# Altium project XC Tail Lights.PrjPcb
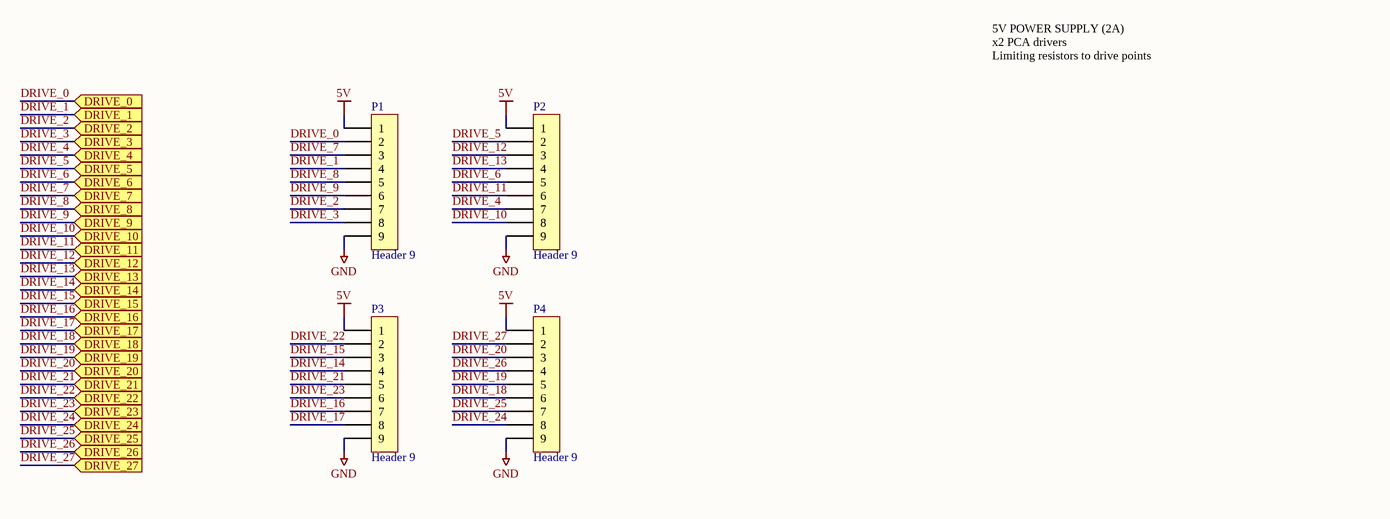
[diagram p0: XC Tail Lights.SchDoc]
3 sheets, 116 parts. Net scope: flat (ports and power ports of the same name join across sheets).
Board files: XC Tail Lights.PcbDoc, LED Module.PcbDoc
Sheets:
  XC Tail Lights.SchDoc
  LED Module.SchDoc
  Current Sinks.SchDoc

## Sheet XC Tail Lights.SchDoc
size A4

### Parts
P1  Header 9  [HEADER 1x9]
P2  Header 9  [HEADER 1x9]
P3  Header 9  [HEADER 1x9]
P4  Header 9  [HEADER 1x9]

### Ports
DRIVE_0 (in), DRIVE_1 (in), DRIVE_2 (in), DRIVE_3 (in), DRIVE_4 (in), DRIVE_5 (in), DRIVE_6 (in), DRIVE_7 (in), DRIVE_8 (in), DRIVE_9 (in), DRIVE_10 (in), DRIVE_11 (in), DRIVE_12 (in), DRIVE_13 (in), DRIVE_14 (in), DRIVE_15 (in), DRIVE_16 (in), DRIVE_17 (in), DRIVE_18 (in), DRIVE_19 (in), DRIVE_20 (in), DRIVE_21 (in), DRIVE_22 (in), DRIVE_23 (in), DRIVE_24 (in), DRIVE_25 (in), DRIVE_26 (in), DRIVE_27 (in)

### Nets
5V: P1.1 P2.1 P3.1 P4.1
GND: P1.9 P2.9 P3.9 P4.9
DRIVE_0: P1.2 ; port DRIVE_0
DRIVE_1: P1.4 ; port DRIVE_1
DRIVE_2: P1.7 ; port DRIVE_2
DRIVE_3: P1.8 ; port DRIVE_3
DRIVE_4: P2.7 ; port DRIVE_4
DRIVE_5: P2.2 ; port DRIVE_5
DRIVE_6: P2.5 ; port DRIVE_6
DRIVE_7: P1.3 ; port DRIVE_7
DRIVE_8: P1.5 ; port DRIVE_8
DRIVE_9: P1.6 ; port DRIVE_9
DRIVE_10: P2.8 ; port DRIVE_10
DRIVE_11: P2.6 ; port DRIVE_11
DRIVE_12: P2.3 ; port DRIVE_12
DRIVE_13: P2.4 ; port DRIVE_13
DRIVE_14: P3.4 ; port DRIVE_14
DRIVE_15: P3.3 ; port DRIVE_15
DRIVE_16: P3.7 ; port DRIVE_16
DRIVE_17: P3.8 ; port DRIVE_17
DRIVE_18: P4.6 ; port DRIVE_18
DRIVE_19: P4.5 ; port DRIVE_19
DRIVE_20: P4.3 ; port DRIVE_20
DRIVE_21: P3.5 ; port DRIVE_21
DRIVE_22: P3.2 ; port DRIVE_22
DRIVE_23: P3.6 ; port DRIVE_23
DRIVE_24: P4.8 ; port DRIVE_24
DRIVE_25: P4.7 ; port DRIVE_25
DRIVE_26: P4.4 ; port DRIVE_26
DRIVE_27: P4.2 ; port DRIVE_27

### Notes on the sheet
- 5V POWER SUPPLY (2A)
  x2 PCA drivers
  Limiting resistors to drive points

### Library data of the parts
P1-P4 = Header 9: Header, 9-Pin; LatestRevisionDate: 17-Jul-2002; LatestRevisionNote: Re-released for DXP Platform.; Publisher: Altium Limited

## Sheet LED Module.SchDoc
size A4
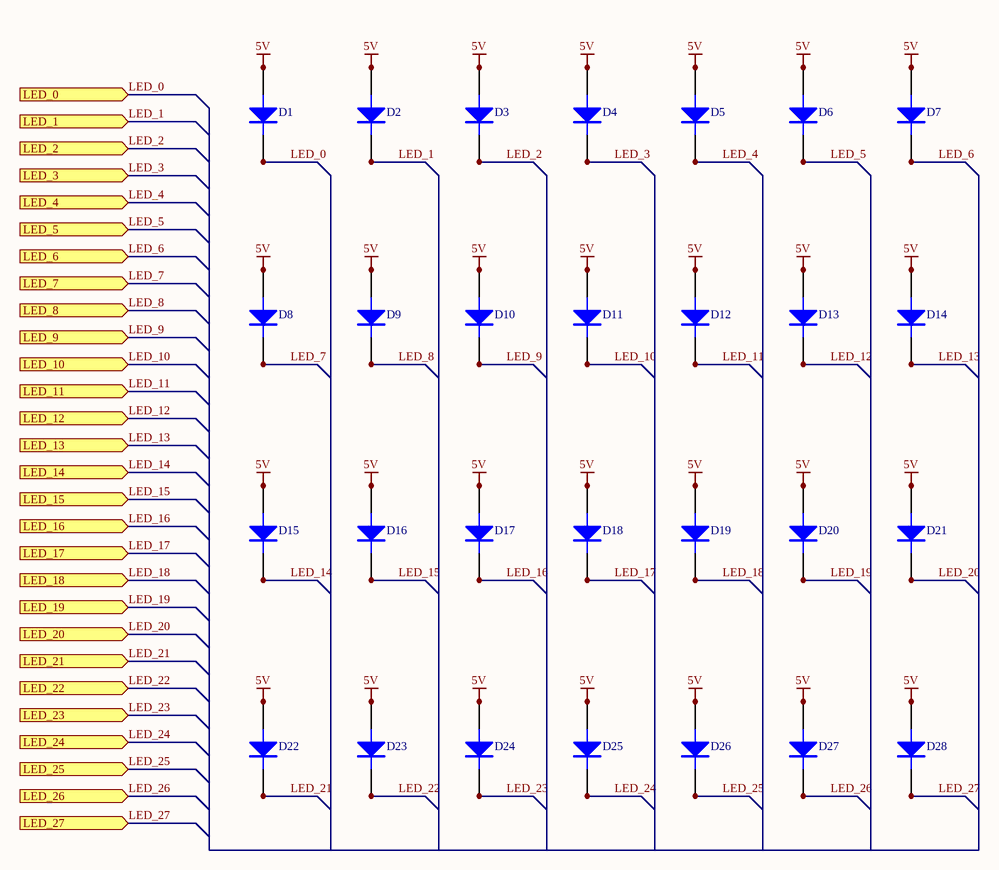
[diagram p1: LED Module.SchDoc]

### Parts
D1  AMBER  [CREE P4 YELLOW]  (value not drawn)
D2  AMBER  [CREE P4 YELLOW]  (value not drawn)
D3  AMBER  [CREE P4 YELLOW]  (value not drawn)
D4  AMBER  [CREE P4 YELLOW]  (value not drawn)
D5  AMBER  [CREE P4 YELLOW]  (value not drawn)
D6  AMBER  [CREE P4 YELLOW]  (value not drawn)
D7  AMBER  [CREE P4 YELLOW]  (value not drawn)
D8  AMBER  [CREE P4 YELLOW]  (value not drawn)
D9  AMBER  [CREE P4 YELLOW]  (value not drawn)
D10  AMBER  [CREE P4 YELLOW]  (value not drawn)
D11  AMBER  [CREE P4 YELLOW]  (value not drawn)
D12  AMBER  [CREE P4 YELLOW]  (value not drawn)
D13  AMBER  [CREE P4 YELLOW]  (value not drawn)
D14  AMBER  [CREE P4 YELLOW]  (value not drawn)
D15  AMBER  [CREE P4 YELLOW]  (value not drawn)
D16  AMBER  [CREE P4 YELLOW]  (value not drawn)
D17  AMBER  [CREE P4 YELLOW]  (value not drawn)
D18  AMBER  [CREE P4 YELLOW]  (value not drawn)
D19  AMBER  [CREE P4 YELLOW]  (value not drawn)
D20  AMBER  [CREE P4 YELLOW]  (value not drawn)
D21  AMBER  [CREE P4 YELLOW]  (value not drawn)
D22  AMBER  [CREE P4 YELLOW]  (value not drawn)
D23  AMBER  [CREE P4 YELLOW]  (value not drawn)
D24  AMBER  [CREE P4 YELLOW]  (value not drawn)
D25  AMBER  [CREE P4 YELLOW]  (value not drawn)
D26  AMBER  [CREE P4 YELLOW]  (value not drawn)
D27  AMBER  [CREE P4 YELLOW]  (value not drawn)
D28  AMBER  [CREE P4 YELLOW]  (value not drawn)

### Ports
LED_0 (in), LED_1 (in), LED_2 (in), LED_3 (in), LED_4 (in), LED_5 (in), LED_6 (in), LED_7 (in), LED_8 (in), LED_9 (in), LED_10 (in), LED_11 (in), LED_12 (in), LED_13 (in), LED_14 (in), LED_15 (in), LED_16 (in), LED_17 (in), LED_18 (in), LED_19 (in), LED_20 (in), LED_21 (in), LED_22 (in), LED_23 (in), LED_24 (in), LED_25 (in), LED_26 (in), LED_27 (in)

### Nets
5V: D1.2(A) D1.3(A) D2.2(A) D2.3(A) D3.2(A) D3.3(A) D4.2(A) D4.3(A) D5.2(A) D5.3(A) D6.2(A) D6.3(A) D7.2(A) D7.3(A) D8.2(A) D8.3(A) D9.2(A) D9.3(A) D10.2(A) D10.3(A) D11.2(A) D11.3(A) D12.2(A) D12.3(A) D13.2(A) D13.3(A) D14.2(A) D14.3(A) D15.2(A) D15.3(A) D16.2(A) D16.3(A) D17.2(A) D17.3(A) D18.2(A) D18.3(A) D19.2(A) D19.3(A) D20.2(A) D20.3(A) D21.2(A) D21.3(A) D22.2(A) D22.3(A) D23.2(A) D23.3(A) D24.2(A) D24.3(A) D25.2(A) D25.3(A) D26.2(A) D26.3(A) D27.2(A) D27.3(A) D28.2(A) D28.3(A)
LED_0: D1.1(K) D1.4(K) ; port LED_0
LED_1: D2.1(K) D2.4(K) ; port LED_1
LED_2: D3.1(K) D3.4(K) ; port LED_2
LED_3: D4.1(K) D4.4(K) ; port LED_3
LED_4: D5.1(K) D5.4(K) ; port LED_4
LED_5: D6.1(K) D6.4(K) ; port LED_5
LED_6: D7.1(K) D7.4(K) ; port LED_6
LED_7: D8.1(K) D8.4(K) ; port LED_7
LED_8: D9.1(K) D9.4(K) ; port LED_8
LED_9: D10.1(K) D10.4(K) ; port LED_9
LED_10: D11.1(K) D11.4(K) ; port LED_10
LED_11: D12.1(K) D12.4(K) ; port LED_11
LED_12: D13.1(K) D13.4(K) ; port LED_12
LED_13: D14.1(K) D14.4(K) ; port LED_13
LED_14: D15.1(K) D15.4(K) ; port LED_14
LED_15: D16.1(K) D16.4(K) ; port LED_15
LED_16: D17.1(K) D17.4(K) ; port LED_16
LED_17: D18.1(K) D18.4(K) ; port LED_17
LED_18: D19.1(K) D19.4(K) ; port LED_18
LED_19: D20.1(K) D20.4(K) ; port LED_19
LED_20: D21.1(K) D21.4(K) ; port LED_20
LED_21: D22.1(K) D22.4(K) ; port LED_21
LED_22: D23.1(K) D23.4(K) ; port LED_22
LED_23: D24.1(K) D24.4(K) ; port LED_23
LED_24: D25.1(K) D25.4(K) ; port LED_24
LED_25: D26.1(K) D26.4(K) ; port LED_25
LED_26: D27.1(K) D27.4(K) ; port LED_26
LED_27: D28.1(K) D28.4(K) ; port LED_27

### Library data of the parts
D1-D28 = CP41B-AFSCM0Q0264: CREE AMBER LED P4 (SUPERFLUX)

## Sheet Current Sinks.SchDoc
size A4
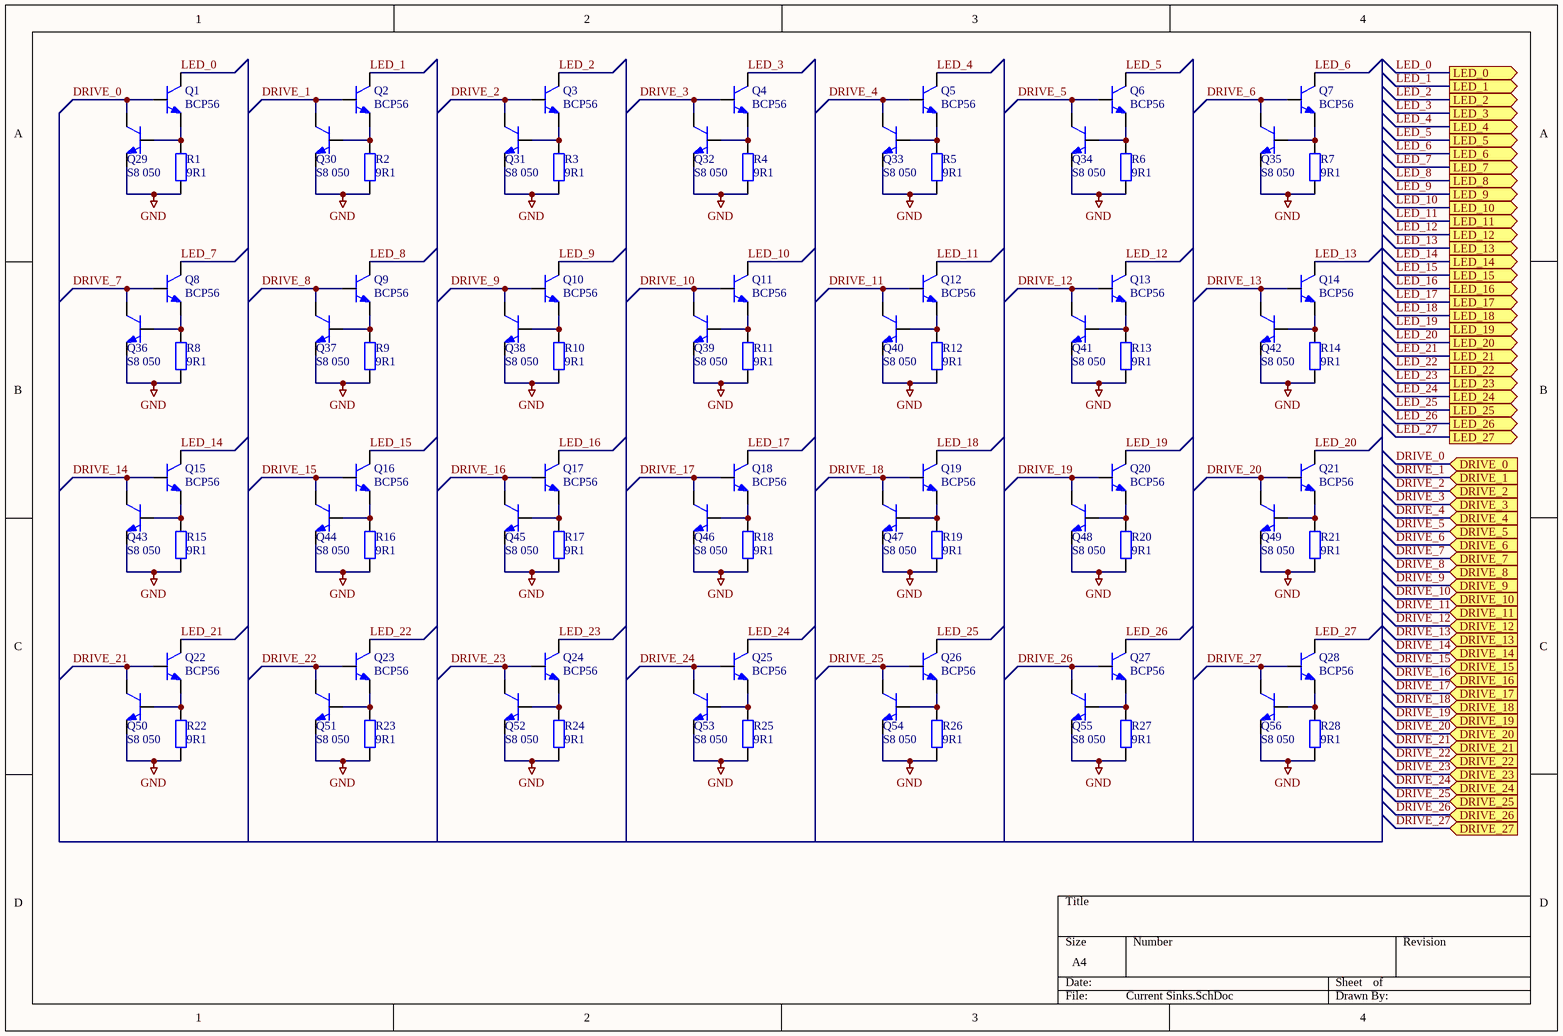
[diagram p2: Current Sinks.SchDoc]

### Parts
Q1  BCP56  [SOT223]
Q2  BCP56  [SOT223]
Q3  BCP56  [SOT223]
Q4  BCP56  [SOT223]
Q5  BCP56  [SOT223]
Q6  BCP56  [SOT223]
Q7  BCP56  [SOT223]
Q8  BCP56  [SOT223]
Q9  BCP56  [SOT223]
Q10  BCP56  [SOT223]
Q11  BCP56  [SOT223]
Q12  BCP56  [SOT223]
Q13  BCP56  [SOT223]
Q14  BCP56  [SOT223]
Q15  BCP56  [SOT223]
Q16  BCP56  [SOT223]
Q17  BCP56  [SOT223]
Q18  BCP56  [SOT223]
Q19  BCP56  [SOT223]
Q20  BCP56  [SOT223]
Q21  BCP56  [SOT223]
Q22  BCP56  [SOT223]
Q23  BCP56  [SOT223]
Q24  BCP56  [SOT223]
Q25  BCP56  [SOT223]
Q26  BCP56  [SOT223]
Q27  BCP56  [SOT223]
Q28  BCP56  [SOT223]
Q29  S8 050  [SOT23-3L]
Q30  S8 050  [SOT23-3L]
Q31  S8 050  [SOT23-3L]
Q32  S8 050  [SOT23-3L]
Q33  S8 050  [SOT23-3L]
Q34  S8 050  [SOT23-3L]
Q35  S8 050  [SOT23-3L]
Q36  S8 050  [SOT23-3L]
Q37  S8 050  [SOT23-3L]
Q38  S8 050  [SOT23-3L]
Q39  S8 050  [SOT23-3L]
Q40  S8 050  [SOT23-3L]
Q41  S8 050  [SOT23-3L]
Q42  S8 050  [SOT23-3L]
Q43  S8 050  [SOT23-3L]
Q44  S8 050  [SOT23-3L]
Q45  S8 050  [SOT23-3L]
Q46  S8 050  [SOT23-3L]
Q47  S8 050  [SOT23-3L]
Q48  S8 050  [SOT23-3L]
Q49  S8 050  [SOT23-3L]
Q50  S8 050  [SOT23-3L]
Q51  S8 050  [SOT23-3L]
Q52  S8 050  [SOT23-3L]
Q53  S8 050  [SOT23-3L]
Q54  S8 050  [SOT23-3L]
Q55  S8 050  [SOT23-3L]
Q56  S8 050  [SOT23-3L]
R1  9R1  [RESISTOR 0805]
R2  9R1  [RESISTOR 0805]
R3  9R1  [RESISTOR 0805]
R4  9R1  [RESISTOR 0805]
R5  9R1  [RESISTOR 0805]
R6  9R1  [RESISTOR 0805]
R7  9R1  [RESISTOR 0805]
R8  9R1  [RESISTOR 0805]
R9  9R1  [RESISTOR 0805]
R10  9R1  [RESISTOR 0805]
R11  9R1  [RESISTOR 0805]
R12  9R1  [RESISTOR 0805]
R13  9R1  [RESISTOR 0805]
R14  9R1  [RESISTOR 0805]
R15  9R1  [RESISTOR 0805]
R16  9R1  [RESISTOR 0805]
R17  9R1  [RESISTOR 0805]
R18  9R1  [RESISTOR 0805]
R19  9R1  [RESISTOR 0805]
R20  9R1  [RESISTOR 0805]
R21  9R1  [RESISTOR 0805]
R22  9R1  [RESISTOR 0805]
R23  9R1  [RESISTOR 0805]
R24  9R1  [RESISTOR 0805]
R25  9R1  [RESISTOR 0805]
R26  9R1  [RESISTOR 0805]
R27  9R1  [RESISTOR 0805]
R28  9R1  [RESISTOR 0805]

### Ports
DRIVE_0 (in), DRIVE_1 (in), DRIVE_2 (in), DRIVE_3 (in), DRIVE_4 (in), DRIVE_5 (in), DRIVE_6 (in), DRIVE_7 (in), DRIVE_8 (in), DRIVE_9 (in), DRIVE_10 (in), DRIVE_11 (in), DRIVE_12 (in), DRIVE_13 (in), DRIVE_14 (in), DRIVE_15 (in), DRIVE_16 (in), DRIVE_17 (in), DRIVE_18 (in), DRIVE_19 (in), DRIVE_20 (in), DRIVE_21 (in), DRIVE_22 (in), DRIVE_23 (in), DRIVE_24 (in), DRIVE_25 (in), DRIVE_26 (in), DRIVE_27 (in), LED_0 (out), LED_1 (out), LED_2 (out), LED_3 (out), LED_4 (out), LED_5 (out), LED_6 (out), LED_7 (out), LED_8 (out), LED_9 (out), LED_10 (out), LED_11 (out), LED_12 (out), LED_13 (out), LED_14 (out), LED_15 (out), LED_16 (out), LED_17 (out), LED_18 (out), LED_19 (out), LED_20 (out), LED_21 (out), LED_22 (out), LED_23 (out), LED_24 (out), LED_25 (out), LED_26 (out), LED_27 (out)

### Nets
GND: Q29.3(E) Q30.3(E) Q31.3(E) Q32.3(E) Q33.3(E) Q34.3(E) Q35.3(E) Q36.3(E) Q37.3(E) Q38.3(E) Q39.3(E) Q40.3(E) Q41.3(E) Q42.3(E) Q43.3(E) Q44.3(E) Q45.3(E) Q46.3(E) Q47.3(E) Q48.3(E) Q49.3(E) Q50.3(E) Q51.3(E) Q52.3(E) Q53.3(E) Q54.3(E) Q55.3(E) Q56.3(E) R1.1 R2.1 R3.1 R4.1 R5.1 R6.1 R7.1 R8.1 R9.1 R10.1 R11.1 R12.1 R13.1 R14.1 R15.1 R16.1 R17.1 R18.1 R19.1 R20.1 R21.1 R22.1 R23.1 R24.1 R25.1 R26.1 R27.1 R28.1
DRIVE_0: Q1.1(B) Q29.2(C) ; port DRIVE_0
DRIVE_1: Q2.1(B) Q30.2(C) ; port DRIVE_1
DRIVE_2: Q3.1(B) Q31.2(C) ; port DRIVE_2
DRIVE_3: Q4.1(B) Q32.2(C) ; port DRIVE_3
DRIVE_4: Q5.1(B) Q33.2(C) ; port DRIVE_4
DRIVE_5: Q6.1(B) Q34.2(C) ; port DRIVE_5
DRIVE_6: Q7.1(B) Q35.2(C) ; port DRIVE_6
DRIVE_7: Q8.1(B) Q36.2(C) ; port DRIVE_7
DRIVE_8: Q9.1(B) Q37.2(C) ; port DRIVE_8
DRIVE_9: Q10.1(B) Q38.2(C) ; port DRIVE_9
DRIVE_10: Q11.1(B) Q39.2(C) ; port DRIVE_10
DRIVE_11: Q12.1(B) Q40.2(C) ; port DRIVE_11
DRIVE_12: Q13.1(B) Q41.2(C) ; port DRIVE_12
DRIVE_13: Q14.1(B) Q42.2(C) ; port DRIVE_13
DRIVE_14: Q15.1(B) Q43.2(C) ; port DRIVE_14
DRIVE_15: Q16.1(B) Q44.2(C) ; port DRIVE_15
DRIVE_16: Q17.1(B) Q45.2(C) ; port DRIVE_16
DRIVE_17: Q18.1(B) Q46.2(C) ; port DRIVE_17
DRIVE_18: Q19.1(B) Q47.2(C) ; port DRIVE_18
DRIVE_19: Q20.1(B) Q48.2(C) ; port DRIVE_19
DRIVE_20: Q21.1(B) Q49.2(C) ; port DRIVE_20
DRIVE_21: Q22.1(B) Q50.2(C) ; port DRIVE_21
DRIVE_22: Q23.1(B) Q51.2(C) ; port DRIVE_22
DRIVE_23: Q24.1(B) Q52.2(C) ; port DRIVE_23
DRIVE_24: Q25.1(B) Q53.2(C) ; port DRIVE_24
DRIVE_25: Q26.1(B) Q54.2(C) ; port DRIVE_25
DRIVE_26: Q27.1(B) Q55.2(C) ; port DRIVE_26
DRIVE_27: Q28.1(B) Q56.2(C) ; port DRIVE_27
LED_0: Q1.2(C) ; port LED_0
LED_1: Q2.2(C) ; port LED_1
LED_2: Q3.2(C) ; port LED_2
LED_3: Q4.2(C) ; port LED_3
LED_4: Q5.2(C) ; port LED_4
LED_5: Q6.2(C) ; port LED_5
LED_6: Q7.2(C) ; port LED_6
LED_7: Q8.2(C) ; port LED_7
LED_8: Q9.2(C) ; port LED_8
LED_9: Q10.2(C) ; port LED_9
LED_10: Q11.2(C) ; port LED_10
LED_11: Q12.2(C) ; port LED_11
LED_12: Q13.2(C) ; port LED_12
LED_13: Q14.2(C) ; port LED_13
LED_14: Q15.2(C) ; port LED_14
LED_15: Q16.2(C) ; port LED_15
LED_16: Q17.2(C) ; port LED_16
LED_17: Q18.2(C) ; port LED_17
LED_18: Q19.2(C) ; port LED_18
LED_19: Q20.2(C) ; port LED_19
LED_20: Q21.2(C) ; port LED_20
LED_21: Q22.2(C) ; port LED_21
LED_22: Q23.2(C) ; port LED_22
LED_23: Q24.2(C) ; port LED_23
LED_24: Q25.2(C) ; port LED_24
LED_25: Q26.2(C) ; port LED_25
LED_26: Q27.2(C) ; port LED_26
LED_27: Q28.2(C) ; port LED_27
NetQ1_3: Q1.3(E) Q29.1(B) R1.2
NetQ2_3: Q2.3(E) Q30.1(B) R2.2
NetQ3_3: Q3.3(E) Q31.1(B) R3.2
NetQ4_3: Q4.3(E) Q32.1(B) R4.2
NetQ5_3: Q5.3(E) Q33.1(B) R5.2
NetQ6_3: Q6.3(E) Q34.1(B) R6.2
NetQ7_3: Q7.3(E) Q35.1(B) R7.2
NetQ8_3: Q8.3(E) Q36.1(B) R8.2
NetQ9_3: Q9.3(E) Q37.1(B) R9.2
NetQ10_3: Q10.3(E) Q38.1(B) R10.2
NetQ11_3: Q11.3(E) Q39.1(B) R11.2
NetQ12_3: Q12.3(E) Q40.1(B) R12.2
NetQ13_3: Q13.3(E) Q41.1(B) R13.2
NetQ14_3: Q14.3(E) Q42.1(B) R14.2
NetQ15_3: Q15.3(E) Q43.1(B) R15.2
NetQ16_3: Q16.3(E) Q44.1(B) R16.2
NetQ17_3: Q17.3(E) Q45.1(B) R17.2
NetQ18_3: Q18.3(E) Q46.1(B) R18.2
NetQ19_3: Q19.3(E) Q47.1(B) R19.2
NetQ20_3: Q20.3(E) Q48.1(B) R20.2
NetQ21_3: Q21.3(E) Q49.1(B) R21.2
NetQ22_3: Q22.3(E) Q50.1(B) R22.2
NetQ23_3: Q23.3(E) Q51.1(B) R23.2
NetQ24_3: Q24.3(E) Q52.1(B) R24.2
NetQ25_3: Q25.3(E) Q53.1(B) R25.2
NetQ26_3: Q26.3(E) Q54.1(B) R26.2
NetQ27_3: Q27.3(E) Q55.1(B) R27.2
NetQ28_3: Q28.3(E) Q56.1(B) R28.2

### Library data of the parts
Q1-Q56 = NPN: BCP56 80 V, 1 A NPN medium power transistors
R1-R28 = Res2: Resistor; Published: 8-Jun-2000; LatestRevisionDate: 17-Jul-2002; LatestRevisionNote: Re-released for DXP Platform.; PackageReference: AXIAL-0.4; Publisher: Altium Limited; PackageDescription: Axial Device, Thru-Hole; 2 Leads; 0.4 in Pin Spacing; Value: 9R1

## Nets that join several sheets
5V: XC Tail Lights (P1.1 P2.1 P3.1 P4.1), LED Module (56 pins)
GND: XC Tail Lights (P1.9 P2.9 P3.9 P4.9), Current Sinks (56 pins)
DRIVE_0: XC Tail Lights (P1.2), Current Sinks (Q1.1 Q29.2)
DRIVE_1: XC Tail Lights (P1.4), Current Sinks (Q2.1 Q30.2)
DRIVE_2: XC Tail Lights (P1.7), Current Sinks (Q3.1 Q31.2)
DRIVE_3: XC Tail Lights (P1.8), Current Sinks (Q4.1 Q32.2)
DRIVE_4: XC Tail Lights (P2.7), Current Sinks (Q5.1 Q33.2)
DRIVE_5: XC Tail Lights (P2.2), Current Sinks (Q6.1 Q34.2)
DRIVE_6: XC Tail Lights (P2.5), Current Sinks (Q7.1 Q35.2)
DRIVE_7: XC Tail Lights (P1.3), Current Sinks (Q8.1 Q36.2)
DRIVE_8: XC Tail Lights (P1.5), Current Sinks (Q9.1 Q37.2)
DRIVE_9: XC Tail Lights (P1.6), Current Sinks (Q10.1 Q38.2)
DRIVE_10: XC Tail Lights (P2.8), Current Sinks (Q11.1 Q39.2)
DRIVE_11: XC Tail Lights (P2.6), Current Sinks (Q12.1 Q40.2)
DRIVE_12: XC Tail Lights (P2.3), Current Sinks (Q13.1 Q41.2)
DRIVE_13: XC Tail Lights (P2.4), Current Sinks (Q14.1 Q42.2)
DRIVE_14: XC Tail Lights (P3.4), Current Sinks (Q15.1 Q43.2)
DRIVE_15: XC Tail Lights (P3.3), Current Sinks (Q16.1 Q44.2)
DRIVE_16: XC Tail Lights (P3.7), Current Sinks (Q17.1 Q45.2)
DRIVE_17: XC Tail Lights (P3.8), Current Sinks (Q18.1 Q46.2)
DRIVE_18: XC Tail Lights (P4.6), Current Sinks (Q19.1 Q47.2)
DRIVE_19: XC Tail Lights (P4.5), Current Sinks (Q20.1 Q48.2)
DRIVE_20: XC Tail Lights (P4.3), Current Sinks (Q21.1 Q49.2)
DRIVE_21: XC Tail Lights (P3.5), Current Sinks (Q22.1 Q50.2)
DRIVE_22: XC Tail Lights (P3.2), Current Sinks (Q23.1 Q51.2)
DRIVE_23: XC Tail Lights (P3.6), Current Sinks (Q24.1 Q52.2)
DRIVE_24: XC Tail Lights (P4.8), Current Sinks (Q25.1 Q53.2)
DRIVE_25: XC Tail Lights (P4.7), Current Sinks (Q26.1 Q54.2)
DRIVE_26: XC Tail Lights (P4.4), Current Sinks (Q27.1 Q55.2)
DRIVE_27: XC Tail Lights (P4.2), Current Sinks (Q28.1 Q56.2)
LED_0: LED Module (D1.1 D1.4), Current Sinks (Q1.2)
LED_1: LED Module (D2.1 D2.4), Current Sinks (Q2.2)
LED_2: LED Module (D3.1 D3.4), Current Sinks (Q3.2)
LED_3: LED Module (D4.1 D4.4), Current Sinks (Q4.2)
LED_4: LED Module (D5.1 D5.4), Current Sinks (Q5.2)
LED_5: LED Module (D6.1 D6.4), Current Sinks (Q6.2)
LED_6: LED Module (D7.1 D7.4), Current Sinks (Q7.2)
LED_7: LED Module (D8.1 D8.4), Current Sinks (Q8.2)
LED_8: LED Module (D9.1 D9.4), Current Sinks (Q9.2)
LED_9: LED Module (D10.1 D10.4), Current Sinks (Q10.2)
LED_10: LED Module (D11.1 D11.4), Current Sinks (Q11.2)
LED_11: LED Module (D12.1 D12.4), Current Sinks (Q12.2)
LED_12: LED Module (D13.1 D13.4), Current Sinks (Q13.2)
LED_13: LED Module (D14.1 D14.4), Current Sinks (Q14.2)
LED_14: LED Module (D15.1 D15.4), Current Sinks (Q15.2)
LED_15: LED Module (D16.1 D16.4), Current Sinks (Q16.2)
LED_16: LED Module (D17.1 D17.4), Current Sinks (Q17.2)
LED_17: LED Module (D18.1 D18.4), Current Sinks (Q18.2)
LED_18: LED Module (D19.1 D19.4), Current Sinks (Q19.2)
LED_19: LED Module (D20.1 D20.4), Current Sinks (Q20.2)
LED_20: LED Module (D21.1 D21.4), Current Sinks (Q21.2)
LED_21: LED Module (D22.1 D22.4), Current Sinks (Q22.2)
LED_22: LED Module (D23.1 D23.4), Current Sinks (Q23.2)
LED_23: LED Module (D24.1 D24.4), Current Sinks (Q24.2)
LED_24: LED Module (D25.1 D25.4), Current Sinks (Q25.2)
LED_25: LED Module (D26.1 D26.4), Current Sinks (Q26.2)
LED_26: LED Module (D27.1 D27.4), Current Sinks (Q27.2)
LED_27: LED Module (D28.1 D28.4), Current Sinks (Q28.2)